# EAGLE design 3xA4B_rev2 (EAGLE 9.6.2)
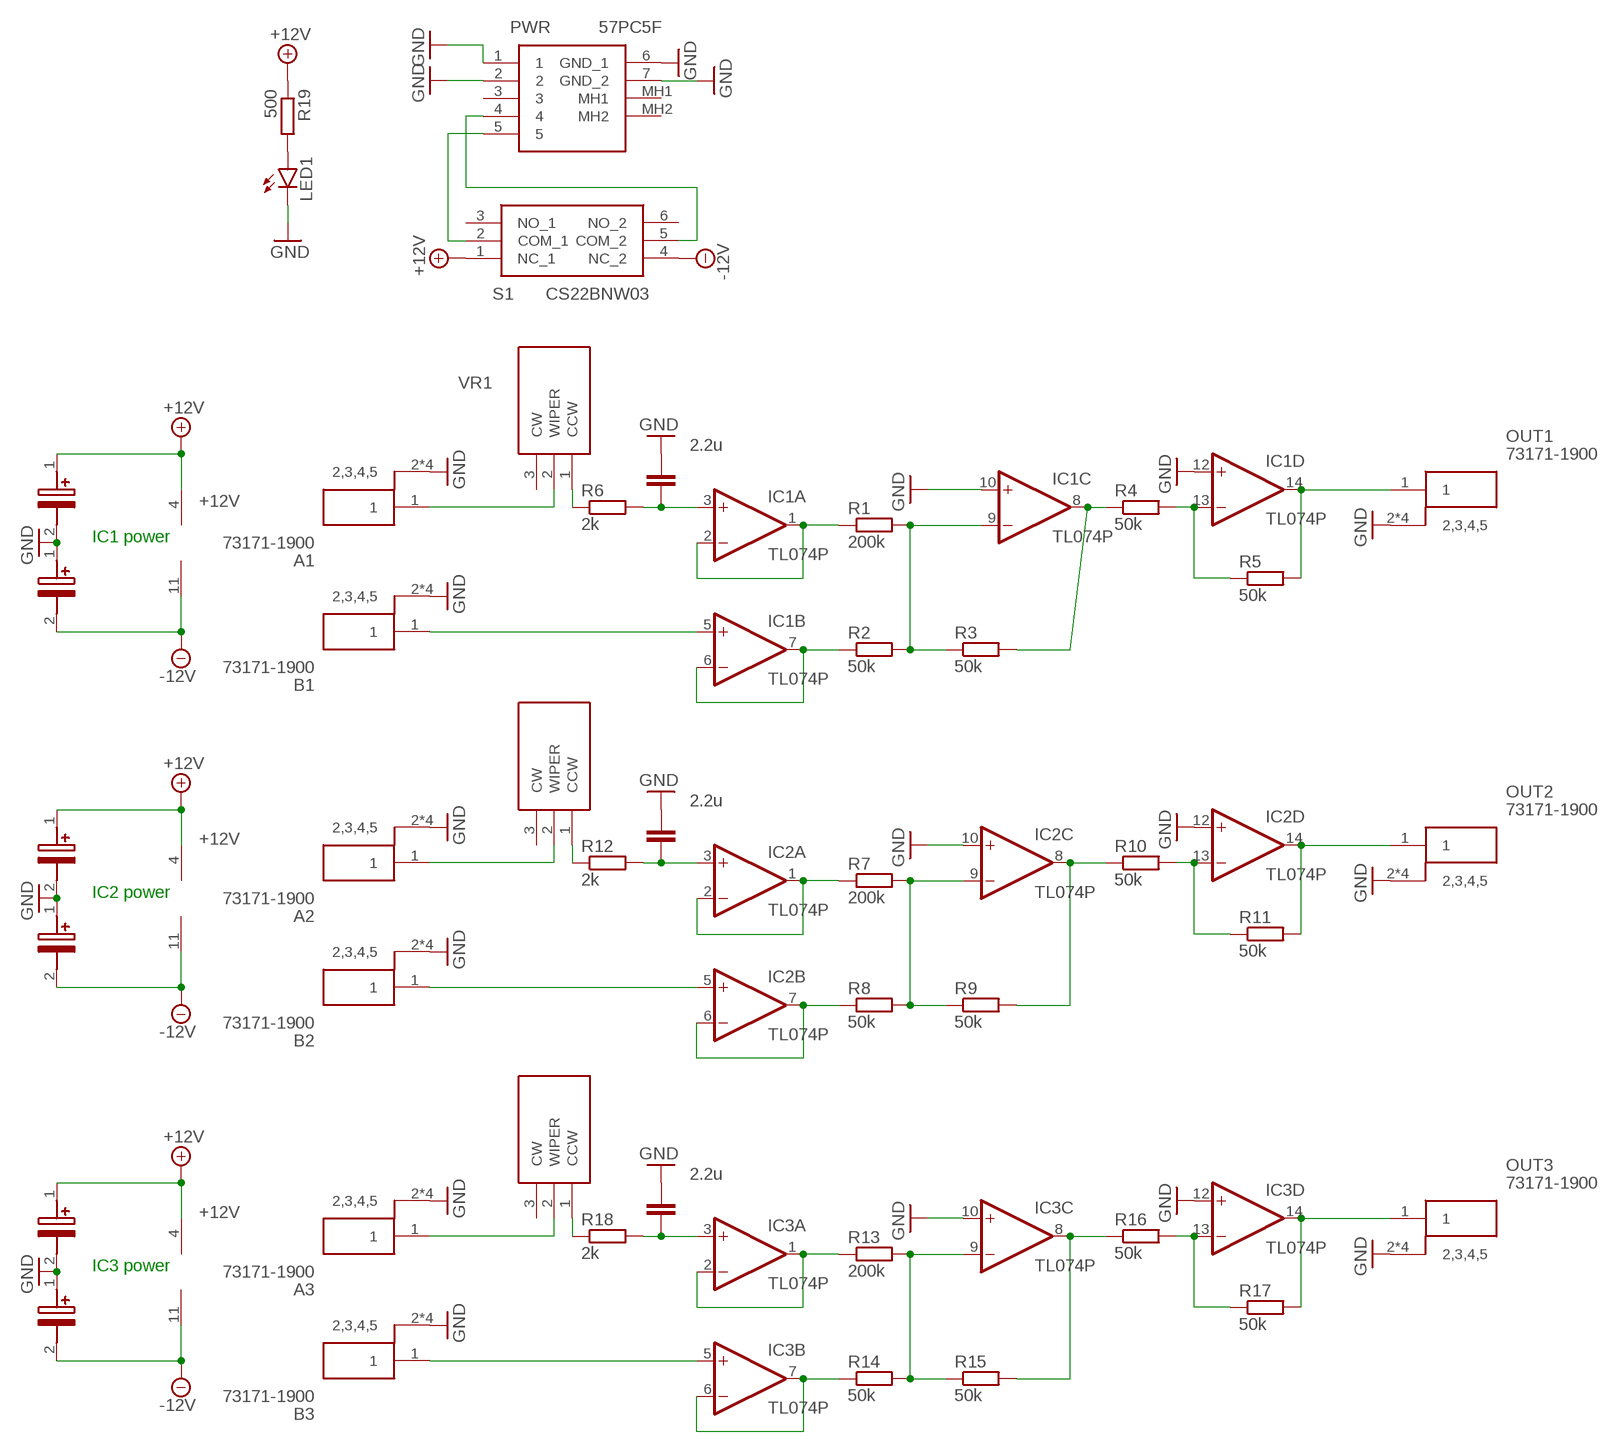
[diagram p0: schematic, sheet 1]

## Parts
A1  73171-1900  [73171-1900]
A2  73171-1900  [73171-1900]
A3  73171-1900  [73171-1900]
B1  73171-1900  [73171-1900]
B2  73171-1900  [73171-1900]
B3  73171-1900  [73171-1900]
C1  TAP225K050GSB  [TAP225K050GSB]
C2  TAP225K050GSB  [TAP225K050GSB]
C3  TAP225K050GSB  [TAP225K050GSB]
C4  TAP225K050GSB  [TAP225K050GSB]
C5  TAP225K050GSB  [TAP225K050GSB]
C6  TAP225K050GSB  [TAP225K050GSB]
IC1  TL074P  [DIL14]
IC2  TL074P  [DIL14]
IC3  TL074P  [DIL14]
LED1  LED3MM  [LED3MM]
OUT1  73171-1900  [73171-1900]
OUT2  73171-1900  [73171-1900]
OUT3  73171-1900  [73171-1900]
PWR  57PC5F  [57PC5F]
R1  200k  R-EU_0207/10  [0207/10]
R2  50k  R-EU_0207/10  [0207/10]
R3  50k  R-EU_0207/10  [0207/10]
R4  50k  R-EU_0207/10  [0207/10]
R5  50k  R-EU_0207/10  [0207/10]
R6  2k  R-EU_0207/10  [0207/10]
R7  200k  R-EU_0207/10  [0207/10]
R8  50k  R-EU_0207/10  [0207/10]
R9  50k  R-EU_0207/10  [0207/10]
R10  50k  R-EU_0207/10  [0207/10]
R11  50k  R-EU_0207/10  [0207/10]
R12  2k  R-EU_0207/10  [0207/10]
R13  200k  R-EU_0207/10  [0207/10]
R14  50k  R-EU_0207/10  [0207/10]
R15  50k  R-EU_0207/10  [0207/10]
R16  50k  R-EU_0207/10  [0207/10]
R17  50k  R-EU_0207/10  [0207/10]
R18  2k  R-EU_0207/10  [0207/10]
R19  500  R-EU_0207/10  [0207/10]
S1  CS22BNW03  [CS22BNW03]
VC1  2.2u  C-EU025-024X044  [C025-024X044]
VC2  2.2u  C-EU025-024X044  [C025-024X044]
VC3  2.2u  C-EU025-024X044  [C025-024X044]
VR1  3299W-1-104LF  [3299W-1-104LF_1]
VR2  3299W-1-104LF  [3299W-1-104LF_1]
VR3  3299W-1-104LF  [3299W-1-104LF_1]

## Nets
+12V: C1.1(+) C3.1(+) C5.1(+) IC1.4(P:V+) IC2.4(P:V+) IC3.4(P:V+) R19.1 S1.1(NC_1)
-12V: C2.2(-) C4.2(-) C6.2(-) IC1.11(P:V-) IC2.11(P:V-) IC3.11(P:V-) S1.4(NC_2)
GND: A1.2(2,3,4,5) A1.3(2,3,4,5) A1.4(2,3,4,5) A1.5(2,3,4,5) A2.2(2,3,4,5) A2.3(2,3,4,5) A2.4(2,3,4,5) A2.5(2,3,4,5) A3.2(2,3,4,5) A3.3(2,3,4,5) A3.4(2,3,4,5) A3.5(2,3,4,5) B1.2(2,3,4,5) B1.3(2,3,4,5) B1.4(2,3,4,5) B1.5(2,3,4,5) B2.2(2,3,4,5) B2.3(2,3,4,5) B2.4(2,3,4,5) B2.5(2,3,4,5) B3.2(2,3,4,5) B3.3(2,3,4,5) B3.4(2,3,4,5) B3.5(2,3,4,5) C1.2(-) C2.1(+) C3.2(-) C4.1(+) C5.2(-) C6.1(+) IC1.10(C:+IN) IC1.12(D:+IN) IC2.10(C:+IN) IC2.12(D:+IN) IC3.10(C:+IN) IC3.12(D:+IN) LED1.K(C) OUT1.2(2,3,4,5) OUT1.3(2,3,4,5) OUT1.4(2,3,4,5) OUT1.5(2,3,4,5) OUT2.2(2,3,4,5) OUT2.3(2,3,4,5) OUT2.4(2,3,4,5) OUT2.5(2,3,4,5) OUT3.2(2,3,4,5) OUT3.3(2,3,4,5) OUT3.4(2,3,4,5) OUT3.5(2,3,4,5) PWR.1 PWR.2 PWR.6(GND_1) PWR.7(GND_2) VC1.1 VC2.1 VC3.1
N$1: IC1.1(A:OUT) IC1.2(A:-IN) R1.1
N$2: IC1.9(C:-IN) R1.2 R2.2 R3.1
N$3: A1.1 VR1.2(WIPER)
N$4: IC1.8(C:OUT) R3.2 R4.1
N$5: IC1.13(D:-IN) R4.2 R5.1
N$6: IC1.14(D:OUT) OUT1.1 R5.2
N$7: IC1.3(A:+IN) R6.2 VC1.2
N$8: B1.1 IC1.5(B:+IN)
N$9: IC1.6(B:-IN) IC1.7(B:OUT) R2.1
N$11: PWR.5 S1.2(COM_1)
N$12: PWR.4 S1.5(COM_2)
N$13: LED1.A R19.2
N$14: IC2.1(A:OUT) IC2.2(A:-IN) R7.1
N$15: IC2.9(C:-IN) R7.2 R8.2 R9.1
N$16: IC2.8(C:OUT) R9.2 R10.1
N$17: IC2.13(D:-IN) R10.2 R11.1
N$18: IC2.14(D:OUT) OUT2.1 R11.2
N$19: IC2.3(A:+IN) R12.2 VC2.2
N$20: B2.1 IC2.5(B:+IN)
N$21: IC2.6(B:-IN) IC2.7(B:OUT) R8.1
N$22: A2.1 VR2.2(WIPER)
N$23: R12.1 VR2.1(CCW)
N$24: IC3.1(A:OUT) IC3.2(A:-IN) R13.1
N$25: IC3.9(C:-IN) R13.2 R14.2 R15.1
N$26: IC3.8(C:OUT) R15.2 R16.1
N$27: IC3.13(D:-IN) R16.2 R17.1
N$28: IC3.14(D:OUT) OUT3.1 R17.2
N$29: IC3.3(A:+IN) R18.2 VC3.2
N$30: B3.1 IC3.5(B:+IN)
N$31: IC3.6(B:-IN) IC3.7(B:OUT) R14.1
N$32: R6.1 VR1.1(CCW)
N$33: A3.1 VR3.2(WIPER)
N$34: R18.1 VR3.1(CCW)
Unconnected: PWR.3 PWR.MH1 PWR.MH2 S1.3(NO_1) S1.6(NO_2) VR1.3(CW) VR2.3(CW) VR3.3(CW)

## Notes on the sheet
- IC1 power
- IC2 power
- IC3 power

## Library data of the parts
A1-A3 B1-B3 OUT1-OUT3 = SamacSys_Parts:73171-1900: MOLEX - 73171-1900 - RF COAXIAL, BNC, STRAIGHT JACK, 75OHM Source: Datasheet <https://www.molex.com/webdocs/datasheets/pdf/en-us/0731711900_RF_COAX_CONNECTORS.pdf>; DESCRIPTION: MOLEX - 73171-1900 - RF COAXIAL, BNC, STRAIGHT JACK, 75OHM; HEIGHT: mm; MANUFACTURER_NAME: Molex; MANUFACTURER_PART_NUMBER: 73171-1900; MOUSER_PART_NUMBER: 538-73171-1900; MOUSER_PRICE-STOCK: https://www.mouser.co.uk/ProductDetail/Molex/73171-1900?qs=kD7lmHUVEJaTHTCbpHnYtg%3D%3D
C1-C6 = SamacSys_Parts:TAP225K050GSB: Tantalum Capacitors - Solid Leaded 50V 2.2uF 10% ESR=3.5 Ohms Source: Datasheet; DESCRIPTION: Tantalum Capacitors - Solid Leaded 50V 2.2uF 10% ESR=3.5 Ohms; HEIGHT: 10.5mm; MANUFACTURER_NAME: AVX; MANUFACTURER_PART_NUMBER: TAP225K050GSB; MOUSER_PART_NUMBER: 581-TAP225K050GSB; MOUSER_PRICE-STOCK: https://www.mouser.co.uk/ProductDetail/AVX/TAP225K050GSB?qs=QbIQBlhseI3a8BcX9HKrAA%3D%3D; OC_NEWARK: unknown
IC1-IC3 = linear:TL074: OP AMP; OC_NEWARK: unknown
LED1 = led:LED: LED OSRAM: - CHIPLED LG R971, LG N971, LY N971, LG Q971, LY Q971, LO R971, LY R971 LH N974, LH R974 LS Q976, LO Q976, LY Q976 LO Q996 - Hyper CHIPLED LW Q18S LB Q993, LB Q99A, LB R99A - SideLED LS A670, LO A670, LY A670, LG A670, LP A670 LB A673, LV A673, LT A673, LW A673 LH A674 LY A675 LS A676, LA A676, LO A676, LY A676, LW A676 LS A679, LY A679, LG A679 - Hyper Micro SIDELED® LS Y876, LA Y876, LO Y876, LY Y876 LT Y87S - SmartLED LW L88C, LW L88S LB L89C, LB L89S, LG L890 LS L89K, LO L89K, LY L89K LS L896, LA L896, LO L896, LY L896 - TOPLED LS T670, LO T670, LY T670, LG T670, LP T670 LSG T670, LSP T670, LSY T670, LOP T670, LYG T670 LG T671, LOG T671, LSG T671 LB T673, LV T673, LT T673, LW T673 LH T674 LS T676, LA T676, LO T676, LY T676, LB T676, LH T676, LSB T676, LW T676 LB T67C, LV T67C, LT T67C, LS T67K, LO T67K, LY T67K, LW E67C LS E67B, LA E67B, LO E67B, LY E67B, LB E67C, LV E67C, LT E67C LW T67C LS T679, LY T679, LG T679 LS T770, LO T770, LY T770, LG T770, LP T770 LB T773, LV T773, LT T773, LW T773 LH T774 LS E675, LA E675, LY E675, LS T675 LS T776, LA T776, LO T776, LY T776, LB T776 LHGB T686 LT T68C, LB T68C - Hyper Mini TOPLED® LB M676 - Mini TOPLED Santana® LG M470 LS M47K, LO M47K, LY M47K Source: http://www.osram.convergy.de LUXEON: - LUMILED® LXK2-PW12-R00, LXK2-PW12-S00, LXK2-PW14-U00, LXK2-PW14-V00 LXK2-PM12-R00, LXK2-PM12-S00, LXK2-PM14-U00 LXK2-PE12-Q00, LXK2-PE12-R00, LXK2-PE12-S00, LXK2-PE14-T00, LXK2-PE14-U00 LXK2-PB12-K00, LXK2-PB12-L00, LXK2-PB12-M00, LXK2-PB14-N00, LXK2-PB14-P00, LXK2-PB14-Q00 LXK2-PR12-L00, LXK2-PR12-M00, LXK2-PR14-Q00, LXK2-PR14-R00 LXK2-PD12-Q00, LXK2-PD12-R00, LXK2-PD12-S00 LXK2-PH12-R00, LXK2-PH12-S00 LXK2-PL12-P00, LXK2-PL12-Q00, LXK2-PL12-R00 Source: www.luxeon.com KINGBRIGHT: KA-3528ASYC Source: www.kingbright.com; OC_NEWARK: unknown
PWR = SamacSys_Parts:57PC5F: Switchcraft 57PC Series, 5 Pole Right Angle Din Socket, 3A, 34 V dc Source: Datasheet <http://www.switchcraft.com/Drawings/57PC5F_CD.pdf>; DESCRIPTION: Switchcraft 57PC Series, 5 Pole Right Angle Din Socket, 3A, 34 V dc; HEIGHT: 21mm; MANUFACTURER_NAME: Switchcraft; MANUFACTURER_PART_NUMBER: 57PC5F; MF: SWITCHCRAFT/CONXALL; MOUSER_PART_NUMBER: 502-57PC5F; MOUSER_PRICE-STOCK: https://www.mouser.co.uk/ProductDetail/Switchcraft/57PC5F?qs=MW%252B0w7tSdpkWuZd7MBoFPA%3D%3D; MPN: 57PC5F; OC_NEWARK: 44F7434
R1-R19 = rcl:R-EU_: RESISTOR, European symbol; OC_NEWARK: unknown; SPICEPREFIX: R
S1 = SamacSys_Parts:CS22BNW03: Slide Switch,DPDT Source: Datasheet <http://www.nkkswitches.com/pdf/cs.pdf>; ARROW_PART_NUMBER: CS22BNW03; ARROW_PRICE-STOCK: https://www.arrow.com/en/products/cs22bnw03/nkk-switches; DESCRIPTION: Slide Switch,DPDT; HEIGHT: 14.8mm; MANUFACTURER_NAME: NKK Switches; MANUFACTURER_PART_NUMBER: CS22BNW03; MF: NKK SWITCHES; MOUSER_PART_NUMBER: 633-CS22BNW03; MOUSER_PRICE-STOCK: https://www.mouser.co.uk/ProductDetail/NKK-Switches/CS22BNW03?qs=EIJ16CYJdOvWYX4DU1mCGA%3D%3D; MPN: CS22BNW03; OC_NEWARK: 09X8792
VC1-VC3 = rcl:C-EU: CAPACITOR, European symbol; OC_NEWARK: unknown; SPICEPREFIX: C
VR1-VR3 = SamacSys_Parts:3299W-1-104LF: 3299W top adj cermet trimmer,100K 10mm Bourns 3299W Series 25-Turn Through Hole Cermet Trimmer Resistor with Pin Terminations, 100000 +/-10% 1/2W +/-100ppm/C Source: Datasheet; DESCRIPTION: 3299W top adj cermet trimmer,100K 10mm Bourns 3299W Series 25-Turn Through Hole Cermet Trimmer Resistor with Pin Terminations, 100000 +/-10% 1/2W +/-100ppm/C; HEIGHT: mm; MANUFACTURER_NAME: Bourns; MANUFACTURER_PART_NUMBER: 3299W-1-104LF; MF: BOURNS; MOUSER_PART_NUMBER: 652-3299W-1-104LF; MOUSER_PRICE-STOCK: https://www.mouser.co.uk/ProductDetail/Bourns/3299W-1-104LF?qs=ctXS0NIXQnpoQSesL4IFGw%3D%3D; MPN: 3299W-1-104LF; OC_NEWARK: 32K7936

## Net classes
0 default: width 0.254 mm, drill 0.254 mm, clearance 0.203 mm

## Board
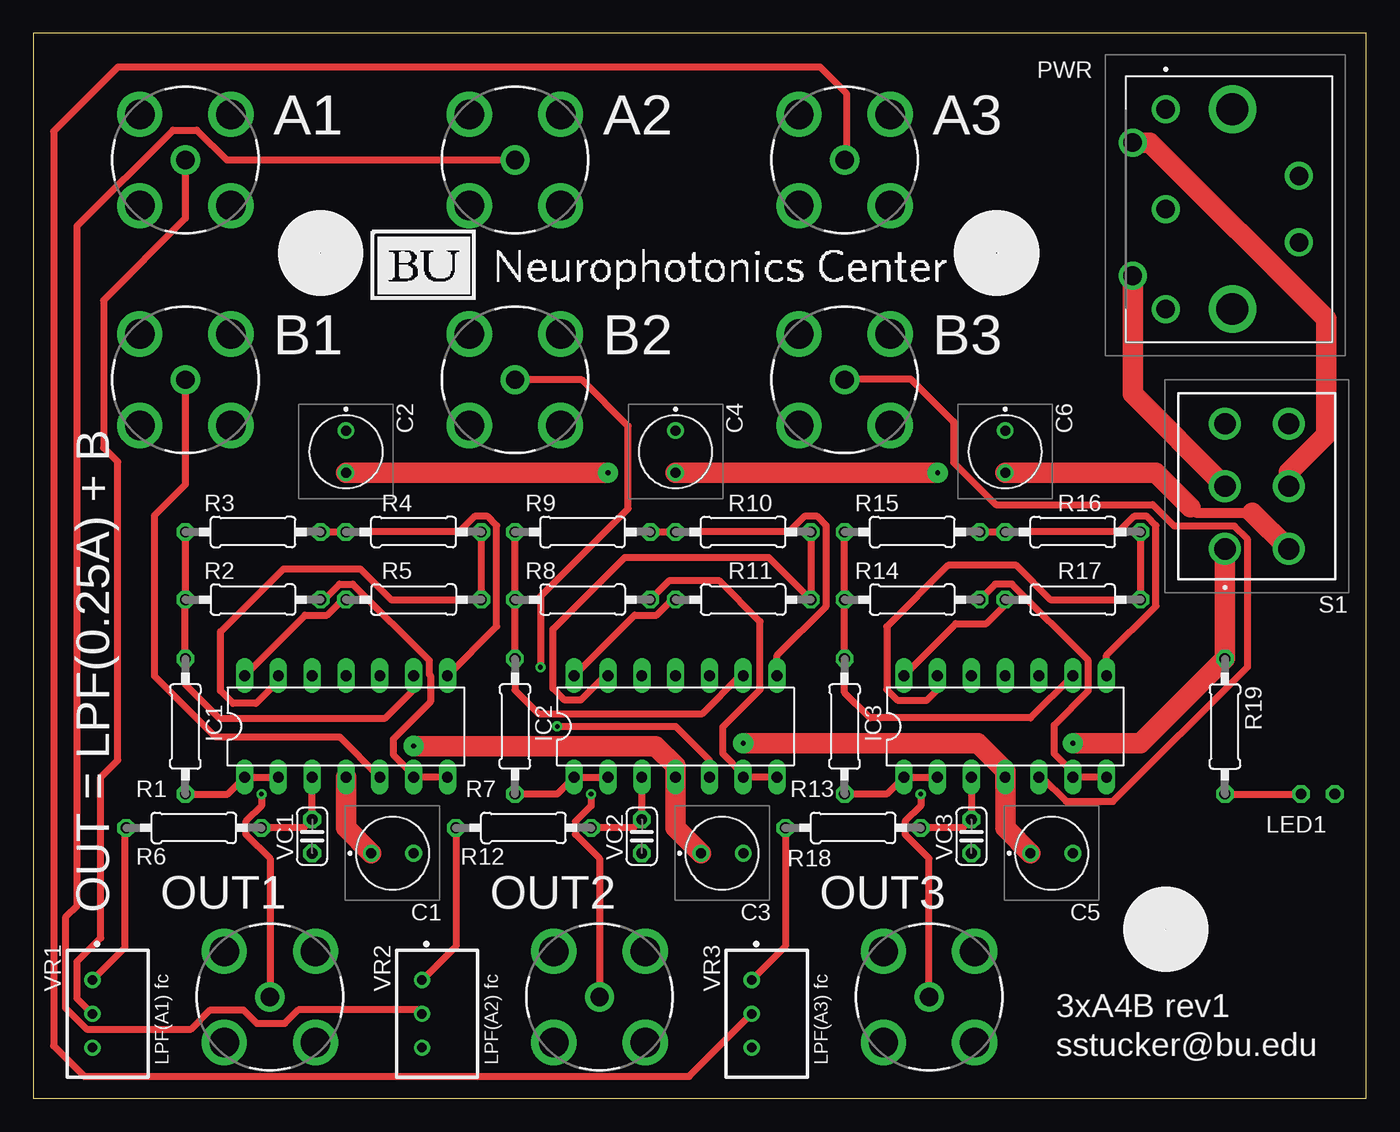
[diagram p1: board, top side]
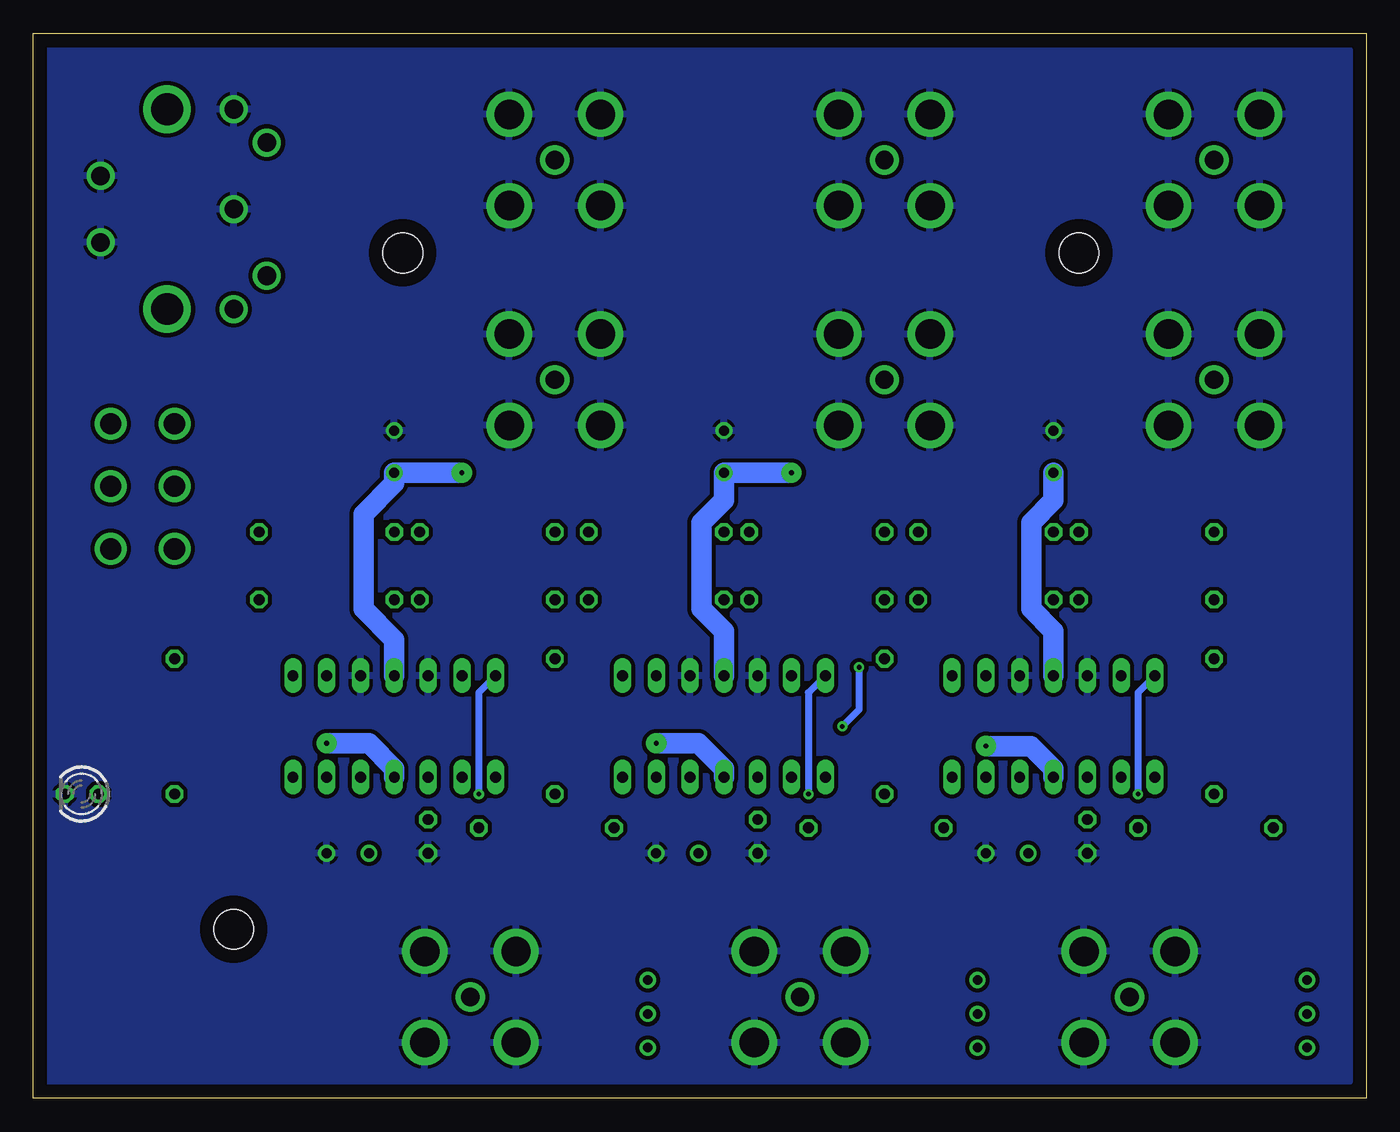
[diagram p2: board, bottom side, seen from below]

Size 100.15 x 80 mm. Coordinates in mm from the lower left corner, seen from the top.
Outline: 0,0 100.15,0 100.15,80 0,80 0,0
Copper layers (1*16): Top 0.035mm / dielectric 1.5mm / Bottom 0.035mm
Design rules "default *": minimum track width 6mil, minimum drill 0.35mm, track to track 12mil, track to pad 10mil, pad to pad 10mil, via to via 10mil, smd to smd 6mil, copper to edge 40mil, drill to drill 6mil, minimum pad ring 10mil, minimum via ring 8mil, stop-mask expansion 4mil, vias tented up to drill 0mil, thermal gap 10mil
Holes 3 mm at 21.59,63.5 72.39,63.5 85.09,12.7

### Footprints (pad centres in the part's own frame; a part is rotated, then mirrored left to right if it is on the bottom)
73171-1900 = drill 1.37 pad 2.2: 1 0,0 | drill 2.21 pad 3.4: 2 -3.43,3.43; 3 3.43,3.43; 4 -3.43,-3.43; 5 3.43,-3.43
TAP225K050GSB = drill 0.75 pad 1.2: 1 0,0; 2 3.18,0
DIL14 = drill 0.813 long: 1 -7.62,-3.81; 2 -5.08,-3.81; 3 -2.54,-3.81; 4 0,-3.81; 5 2.54,-3.81; 6 5.08,-3.81; 7 7.62,-3.81; 8 7.62,3.81; 9 5.08,3.81; 10 2.54,3.81; 11 0,3.81; 12 -2.54,3.81; 13 -5.08,3.81; 14 -7.62,3.81
LED3MM = drill 0.813 octagon: A -1.27,0; K 1.27,0
57PC5F = drill 1.4 pad 2.1: 1 0,0; 2 0,7.505; 3 0,15.01; 4 2.49,2.5; 5 2.49,12.51; 6 -10.01,5.005; 7 -10.01,10.005 | drill 2.39 pad 3.585: MH1 -5.01,0; MH2 -5.01,15.01
0207/10 = drill 0.813 octagon: 1 -5.08,0; 2 5.08,0
CS22BNW03 = drill 1.6 pad 2.4: 1 0,0; 2 0,4.7; 3 0,9.4; 4 4.8,0; 5 4.8,4.7; 6 4.8,9.4
C025-024X044 = drill 0.813 octagon: 1 -1.27,0; 2 1.27,0
3299W-1-104LF_1 = drill 0.71 pad 1.21: 1 0,-2.54; 2 0,0; 3 0,2.54

### Placement (x,y rotation side)
A1  11.43,70.48 0 top
A2  36.2,70.48 0 top
A3  60.96,70.48 0 top
B1  11.43,53.98 0 top
B2  36.2,53.98 0 top
B3  60.96,53.98 0 top
C1  25.4,18.41 0 top
C2  23.5,50.16 270 top
C3  50.16,18.41 0 top
C4  48.26,50.16 270 top
C5  74.93,18.41 0 top
C6  73.03,50.16 270 top
IC1  23.5,27.94 0 top
IC2  48.26,27.94 0 top
IC3  73.03,27.94 0 top
LED1  96.52,22.86 180 bottom
OUT1  17.78,7.62 0 top
OUT2  42.55,7.62 0 top
OUT3  67.31,7.62 0 top
PWR  85.09,74.3 180 top
R1  11.43,27.94 90 top
R2  16.51,37.47 180 top
R3  16.51,42.55 0 top
R4  28.57,42.55 0 top
R5  28.57,37.47 180 top
R6  12.06,20.32 0 top
R7  36.2,27.94 90 top
R8  41.27,37.47 180 top
R9  41.27,42.55 0 top
R10  53.34,42.55 0 top
R11  53.34,37.47 180 top
R12  36.83,20.32 0 top
R13  60.96,27.94 90 top
R14  66.04,37.47 180 top
R15  66.04,42.55 0 top
R16  78.11,42.55 0 top
R17  78.11,37.47 180 top
R18  61.59,20.32 0 top
R19  89.53,27.94 270 top
S1  89.53,41.27 0 top
VC1  20.95,19.68 90 top
VC2  45.72,19.68 90 top
VC3  70.48,19.68 90 top
VR1  4.45,6.35 180 top
VR2  29.21,6.35 180 top
VR3  53.98,6.35 180 top

### Tracks (layer width: path | path; a pad name or v marks a point on that pad's centre or on a via)
+12V  (via drill 0.35 pad 1.52)
  Top 1.524: S1.1 R19.1 83.19,26.67 v78.11,26.67 | v53.34,26.67 70.98,26.67 73.03,24.62 IC3.4 73.03,20.32 C5.1 | v28.57,26.47 46.76,26.47 48.26,24.97 IC2.4 48.26,20.32 C3.1 | C1.1 23.5,20.32 IC1.4
  Bottom 1.524: IC2.4 48.26,24.77 50.16,26.67 v53.34,26.67 | IC1.4 23.5,24.77 25.2,26.47 v28.57,26.47 | v78.11,26.67 74.93,26.67 73.03,24.77 IC3.4
-12V  (via drill 0.35 pad 1.52)
  Top 0.762: 86.94,44.39 87.34,44 91.61,44
  Top 1.524: C6.2 84.35,46.98 86.94,44.39 | v67.94,46.99 C4.2 | v43.18,46.99 C2.2 | 91.61,44 S1.4
  Bottom 1.524: v67.94,46.99 v67.95,46.98 C6.2 73.03,46.19 75.34,43.87 75.34,36.77 73.03,34.46 IC3.11 | v43.18,46.99 v43.19,46.98 C4.2 48.26,44.92 49.94,43.24 49.94,36.77 48.26,35.09 IC2.11 | IC1.11 23.5,35.09 25.17,36.77 25.17,43.24 23.5,44.92 C2.2
GND
  pour Bottom: 1.27,1.27 99.06,1.27 99.06,78.74 1.27,78.74
N$1
  Top 0.508: R1.1 14.61,22.86 IC1.1 IC1.2
N$2
  Top 0.508: R3.1 R2.2 R1.2 11.43,31.11 14.02,28.52 26.39,28.52 28.57,30.71 IC1.9
N$3
  Top 0.508: VR1.2 3.3,7.49 3.3,10.29 5.08,12.06 5.08,24.13 6.35,25.4 6.35,47.8 5.28,48.87 5.28,59.95 11.43,66.09 A1.1
N$4
  Top 0.508: R3.2 R4.1 32,42.55 33.17,43.71 34.14,43.71 34.82,43.03 34.82,35.46 IC1.8
N$5
  Top 0.508: R4.2 R5.1 26.89,37.47 24.57,39.78 18.8,39.78 14.07,35.05 14.07,30.61 15.01,29.67 16.74,29.67 18.41,31.34 IC1.13
N$6  (via drill 0.35)
  Top 0.508: IC1.14 20.42,36.3 22.07,36.3 23.24,37.47 R5.2 | v17.14,22.86 17.14,21.97 15.98,20.8 15.98,19.84 17.78,18.03 OUT1.1
  Bottom 0.508: IC1.14 17.14,30.48 v17.14,22.86
N$7
  Top 0.508: R6.2 20.32,20.32 VC1.2 IC1.3
N$8
  Top 0.508: IC1.5 23.04,27.13 13.71,27.13 9.12,31.71 9.12,43.79 11.43,46.1 B1.1
N$9
  Top 0.508: IC1.7 IC1.6 28.57,24.29 27.05,25.81 27.05,26.99 29.84,29.79 29.84,31.75 29.74,31.85 29.74,32.89 24,38.63 23.01,38.63 21.84,37.47 R2.1
N$11
  Top 1.524: S1.2 82.6,52.91 PWR.5
N$12
  Top 1.524: S1.5 94.33,47.03 97.16,49.85 97.16,58.55 83.91,71.8 PWR.4
N$13
  Top 0.508: R19.2 LED1.A
N$14
  Top 0.508: R7.1 39.37,22.86 IC2.1 IC2.2
N$15
  Top 0.508: R9.1 R8.2 R7.2 36.2,30.67 37.96,28.91 50.27,28.91 53.11,31.75 IC2.9
N$16
  Top 0.508: R9.2 R10.1 56.77,42.55 57.94,43.71 58.9,43.71 59.59,43.03 59.59,36.98 55.88,33.27 IC2.8
N$17
  Top 0.508: R10.2 R11.1 55.24,40.64 44.45,40.64 39.05,35.24 39.05,30.8 39.93,29.92 41.12,29.92 42.95,31.75 IC2.13
N$18  (via drill 0.35)
  Top 0.508: IC2.14 45.19,36.3 46.84,36.3 48.01,37.47 R11.2 | v41.91,22.86 41.91,21.97 40.74,20.8 40.74,19.84 42.55,18.03 OUT2.1
  Bottom 0.508: IC2.14 41.91,30.48 v41.91,22.86
N$19
  Top 0.508: IC2.3 VC2.2 45.09,20.32 R12.2
N$20  (via drill 0.35)
  Top 0.508: v38.1,32.38 38.1,37.7 44.7,44.3 44.7,50.49 41.22,53.98 B2.1 | v39.37,27.94 48.26,27.94 50.8,25.4 IC2.5
  Bottom 0.508: v38.1,32.38 38.1,29.21 v39.37,27.94
N$21
  Top 0.508: IC2.7 IC2.6 53.34,24.37 51.82,25.89 51.82,27.91 54.61,30.71 54.61,35.81 51.56,38.86 47.75,38.86 R8.1
N$22
  Top 0.508: A2.1 14.53,70.48 12.29,72.73 10.5,72.73 3.3,65.53 3.3,14.48 2.41,13.59 2.41,6.8 4.01,5.21 11.86,5.21 13.31,6.65 15.77,6.65 16.79,5.63 18.89,5.63 19.91,6.65 28.91,6.65 VR2.2
N$23
  Top 0.508: R12.1 31.75,11.43 VR2.1
N$24
  Top 0.508: IC3.2 IC3.1 64.14,22.86 R13.1
N$25
  Top 0.508: R15.1 R14.2 R13.2 60.96,30.48 62.87,28.57 74.93,28.57 IC3.9
N$26
  Top 0.508: R15.2 R16.1 81.53,42.55 82.7,43.71 83.67,43.71 84.35,43.03 84.35,36.98 80.64,33.27 IC3.8
N$27
  Top 0.508: R16.2 R17.1 76.42,37.47 73.85,40.03 68.73,40.03 64.14,35.43 64.14,30.71 64.92,29.92 67.16,29.92 67.94,30.71 IC3.13
N$28  (via drill 0.35)
  Top 0.508: IC3.14 69.32,35.66 71.6,35.66 73.03,37.08 R17.2 | v66.67,22.86 66.67,21.97 65.51,20.8 65.51,19.84 67.31,18.03 OUT3.1
  Bottom 0.508: IC3.14 66.67,30.48 v66.67,22.86
N$29
  Top 0.508: IC3.3 VC3.2 69.85,20.32 R18.2
N$30
  Top 0.508: IC3.5 75.79,24.13 77.62,22.3 81.13,22.3 91.24,32.41 91.24,41.98 90.24,42.98 85.73,42.98 84.11,44.6 72.31,44.6 69.14,47.77 69.14,50.83 65.94,54.02 61.01,54.02 B3.1
N$31
  Top 0.508: IC3.7 IC3.6 78.11,24.49 76.71,25.89 76.71,28.04 79.27,30.61 79.27,32.89 73.53,38.63 72.29,38.63 R14.1
N$32
  Top 0.508: VR1.1 6.86,11.3 6.86,20.19 R6.1
N$33
  Top 0.508: VR3.2 49.28,1.65 3.81,1.65 1.52,3.94 1.52,72.63 6.35,77.46 59.14,77.46 61.09,75.51 61.09,70.61 A3.1
N$34
  Top 0.508: R18.1 56.52,11.43 VR3.1

### Text on the board
tNames: OUT = LPF(0.25A) + B | 3xA4B rev1 | LPF(A1) fc | LPF(A2) fc | LPF(A3) fc | sstucker@bu.edu